# EAGLE design GRBLduino_Uno_Rev3-02-TH (EAGLE 7.6.0)

## Sheet 1 of 2
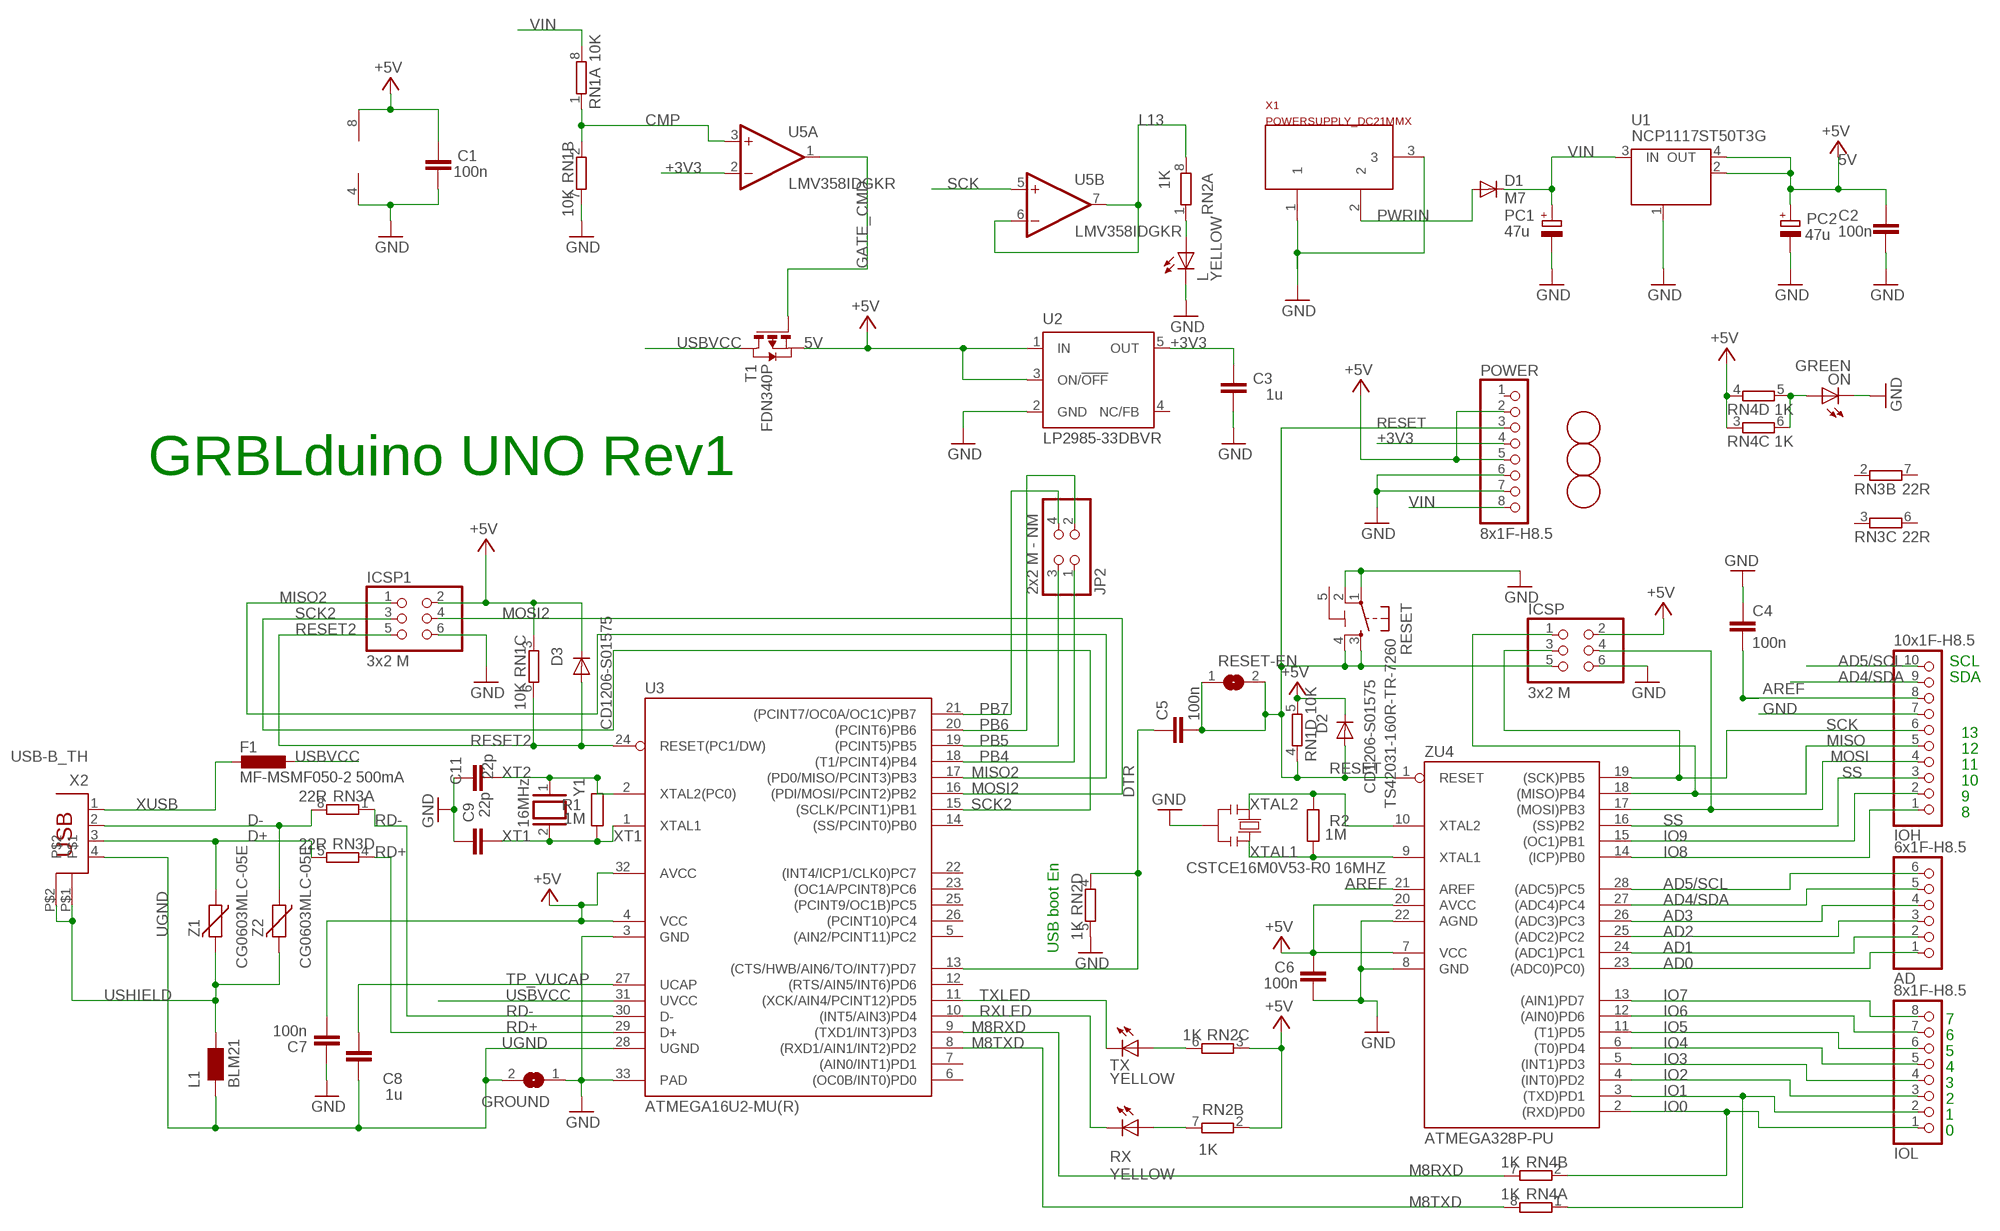
[diagram p0: schematic, sheet 1]

### Parts
AD  6x1F-H8.5  PINHD-1X6  [1X06]
C1  100n  C-EU0603-RND  [C0603-ROUND]
C2  100n  C-EU0603-RND  [C0603-ROUND]
C3  1u  C-EU0603-RND  [C0603-ROUND]
C4  100n  C-EU0603-RND  [C0603-ROUND]
C5  100n  C-EU0603-RND  [C0603-ROUND]
C6  100n  C-EU0603-RND  [C0603-ROUND]
C7  100n  C-EU0603-RND  [C0603-ROUND]
C8  1u  C-EU0603-RND  [C0603-ROUND]
C9  22p  C-EU0603-RND  [C0603-ROUND]
C11  22p  C-EU0603-RND  [C0603-ROUND]
D1  M7  DIODE-SMB  [SMB]
D2  CD1206-S01575  DIODE-MINIMELF  [MINIMELF]
D3  CD1206-S01575  DIODE-MINIMELF  [MINIMELF]
F1  MF-MSMF050-2 500mA  L-EUL1812  [L1812]
FD1  FIDUCIALMOUNT  [FIDUCIA-MOUNT]
FD2  FIDUCIALMOUNT  [FIDUCIA-MOUNT]
FD3  FIDUCIALMOUNT  [FIDUCIA-MOUNT]
GROUND  SJ  [SJ]
ICSP  3x2 M  PINHD-2X3  [2X03]
ICSP1  3x2 M  PINHD-2X3  [2X03]
IOH  10x1F-H8.5  PINHD-1X10_ARD  [1X10]
IOL  8x1F-H8.5  PINHD-1X8  [1X08]
JP2  2x2 M - NM  PINHD-2X2  [2X02]
L  YELLOW  LEDCHIP-LED0805  [CHIP-LED0805]
L1  BLM21  WE-CBF_0805  [0805]
ON  GREEN  LEDCHIP-LED0805  [CHIP-LED0805]
PC1  47u  CPOL-EUD  [PANASONIC_D]
PC2  47u  CPOL-EUD  [PANASONIC_D]
POWER  8x1F-H8.5  PINHD-1X8  [1X08]
R1  1M  R-EU_R0603  [R0603-ROUND]
R2  1M  R-EU_R0603  [R0603-ROUND]
RESET  TS42031-160R-TR-7260  TS42  [TS42]
RESET-EN  SJ  [SJ]
RN1  10K  4R-NCAY16  [CAY16]
RN2  1K  4R-NCAY16  [CAY16]
RN3  22R  4R-NCAY16  [CAY16]
RN4  1K  4R-NCAY16  [CAY16]
RX  YELLOW  LEDCHIP-LED0805  [CHIP-LED0805]
T1  FDN340P  PMOSSOT23  [SOT-23]
TX  YELLOW  LEDCHIP-LED0805  [CHIP-LED0805]
U1  NCP1117ST50T3G  MC33269ST-3.3T3  [SOT223]
U2  LP2985-33DBVR  LP2985-XXDBVR33  [SOT23-DBV]
U3  ATMEGA16U2-MU(R)  ATMEGA16U2-MU  [MLF32]
U5  LMV358IDGKR  LMV358MMX  [MSOP08]
X1  POWERSUPPLY_DC21MMX  [POWERSUPPLY_DC-21MM]
X2  USB-B_TH  PN61729  [PN61729]
Y1  16MHz  XTAL/S  [QS]
Y2  CSTCE16M0V53-R0 16MHZ  RESONATORMU  [RESONATOR]
Z1  CG0603MLC-05E  VARISTORCN0603  [CT/CN0603]
Z2  CG0603MLC-05E  VARISTORCN0603  [CT/CN0603]
ZU4  ATMEGA328P-PU  [DIL28-3]

### Nets
5V: C1.2 C2.2 C6.2 C7.1 D2.C D3.C ICSP1.2 ICSP.2 PC2.+ POWER.2 POWER.5 RN1.3 RN1.5 RN2.2 RN2.3 RN4.3 RN4.4 T1.2(S) U1.2(OUT) U1.4(OUT) U2.1(IN) U2.3(ON/!OFF) U3.4(VCC) U3.32(AVCC) U5.8(P:V+) ZU4.7(VCC) ZU4.20(AVCC) ; supply symbol labelled +5V ; also sheet 2
+3V3: C3.2 POWER.4 U2.5(OUT) U5.2(A:-IN)
AD0: AD.1 ZU4.23((ADC0)PC0)) ; also sheet 2
AD1: AD.2 ZU4.24((ADC1)PC1) ; also sheet 2
AD2: AD.3 ZU4.25((ADC2)PC2) ; also sheet 2
AD3: AD.4 ZU4.26((ADC3)PC3) ; also sheet 2
AD4/SDA: AD.5 IOH.9 ZU4.27((ADC4)PC4) ; also sheet 2
AD5/SCL: AD.6 IOH.10 ZU4.28((ADC5)PC5) ; also sheet 2
AREF [aref]: C4.2 IOH.8 ZU4.21(AREF)
CMP: RN1.1 RN1.2 U5.3(A:+IN)
D+: RN3.5 X2.3 Z1.1
D-: RN3.8 X2.2 Z2.1
DTR: C5.1 RN2.4 U3.13((CTS/HWB/AIN6/TO/INT7)PD7)
GATE_CMD: T1.3(G) U5.1(A:OUT)
GND [GND]: C1.1 C2.1 C3.1 C4.1 C6.1 C7.2 C9.2 C11.2 GROUND.1 ICSP1.6 ICSP.6 IOH.7 L.C ON.C PC1.- PC2.- POWER.6 POWER.7 RESET.1 RESET.2 RN1.7 RN2.5 U1.1(GND/ADJ) U2.2(GND) U3.3(GND) U3.33(PAD) U5.4(P:V-) X1.1 X1.3 Y2.2 ZU4.8(GND) ZU4.22(AGND) ; also sheet 2
IO0: IOL.1 RN4.2 ZU4.2((RXD)PD0)
IO1: IOL.2 RN4.1 ZU4.3((TXD)PD1)
IO2: IOL.3 ZU4.4((INT0)PD2) ; also sheet 2
IO3: IOL.4 ZU4.5((INT1)PD3) ; also sheet 2
IO4: IOL.5 ZU4.6((T0)PD4) ; also sheet 2
IO5: IOL.6 ZU4.11((T1)PD5) ; also sheet 2
IO6: IOL.7 ZU4.12((AIN0)PD6) ; also sheet 2
IO7: IOL.8 ZU4.13((AIN1)PD7) ; also sheet 2
IO8: IOH.1 ZU4.14((ICP)PB0) ; also sheet 2
IO9: IOH.2 ZU4.15((OC1)PB1) ; also sheet 2
L13: RN2.8 U5.6(B:-IN) U5.7(B:OUT)
M8RXD: RN4.7 U3.9((TXD1/INT3)PD3)
M8TXD: RN4.8 U3.8((RXD1/AIN1/INT2)PD2)
MISO: ICSP.1 IOH.5 ZU4.18((MISO)PB4) ; also sheet 2
MISO2: ICSP1.1 U3.17((PD0/MISO/PCINT3)PB3)
MOSI: ICSP.4 IOH.4 ZU4.17((MOSI)PB3) ; also sheet 2
MOSI2: ICSP1.4 U3.16((PDI/MOSI/PCINT2)PB2)
N$1: L.A RN2.1
N$3: ON.A RN4.5 RN4.6
N$35: RN2.7 RX.A
N$36: RN2.6 TX.A
PB4: JP2.1 U3.18((T1/PCINT4)PB4)
PB5: JP2.3 U3.19((PCINT5)PB5)
PB6: JP2.2 U3.20((PCINT6)PB6)
PB7: JP2.4 U3.21((PCINT7/OC0A/OC1C)PB7)
PWRIN [power]: D1.A X1.2
RD+: RN3.4 U3.29(D+)
RD-: RN3.1 U3.30(D-)
RESET: C5.2 D2.A ICSP.5 POWER.3 RESET-EN.1 RESET-EN.2 RESET.3 RESET.4 RN1.4 ZU4.1(RESET) ; also sheet 2
RESET2: D3.A ICSP1.5 RN1.6 U3.24(RESET(PC1/DW))
RXLED: RX.C U3.10((INT5/AIN3)PD4)
SCK: ICSP.3 IOH.6 U5.5(B:+IN) ZU4.19((SCK)PB5) ; also sheet 2
SCK2: ICSP1.3 U3.15((SCLK/PCINT1)PB1)
SS: IOH.3 ZU4.16((SS)PB2) ; also sheet 2
TP_VUCAP: C8.1 U3.27(UCAP)
TXLED: TX.C U3.11((XCK/AIN4/PCINT12)PD5)
UGND [GND]: C8.2 GROUND.2 L1.1 U3.28(UGND) X2.4
USBVCC [usbvcc]: F1.1 T1.1(D) U3.31(UVCC)
USHIELD [GND]: L1.2 X2.P$1 X2.P$2 Z1.2 Z2.2
VIN [power]: D1.C PC1.+ POWER.8 RN1.8 U1.3(IN)
XT1: C9.1 R1.1 U3.1(XTAL1) Y1.2
XT2: C11.1 R1.2 U3.2(XTAL2(PC0)) Y1.1
XTAL1: R2.1 Y2.3 ZU4.9(XTAL1)
XTAL2: R2.2 Y2.1 ZU4.10(XTAL2)
XUSB [usbvcc]: F1.2 X2.1
Unconnected: POWER.1 RN3.2 RN3.3 RN3.6 RN3.7 U2.4(NC/FB) U3.5((AIN2/PCINT11)PC2) U3.6((OC0B/INT0)PD0) U3.7((AIN0/INT1)PD1) U3.12((RTS/AIN5/INT6)PD6) U3.14((SS/PCINT0)PB0) U3.22((INT4/ICP1/CLK0)PC7) U3.23((OC1A/PCINT8)PC6) U3.25((PCINT9/OC1B)PC5) U3.26((PCINT10)PC4)

### Notes on the sheet
- GRBLduino UNO Rev1
- SCL
- SDA
- 13
- 12
- 11
- 10
- 9
- 8
- USB boot En
- 7
- 6
- 5
- 4
- 3
- 2
- 1
- 0

## Sheet 2 of 2
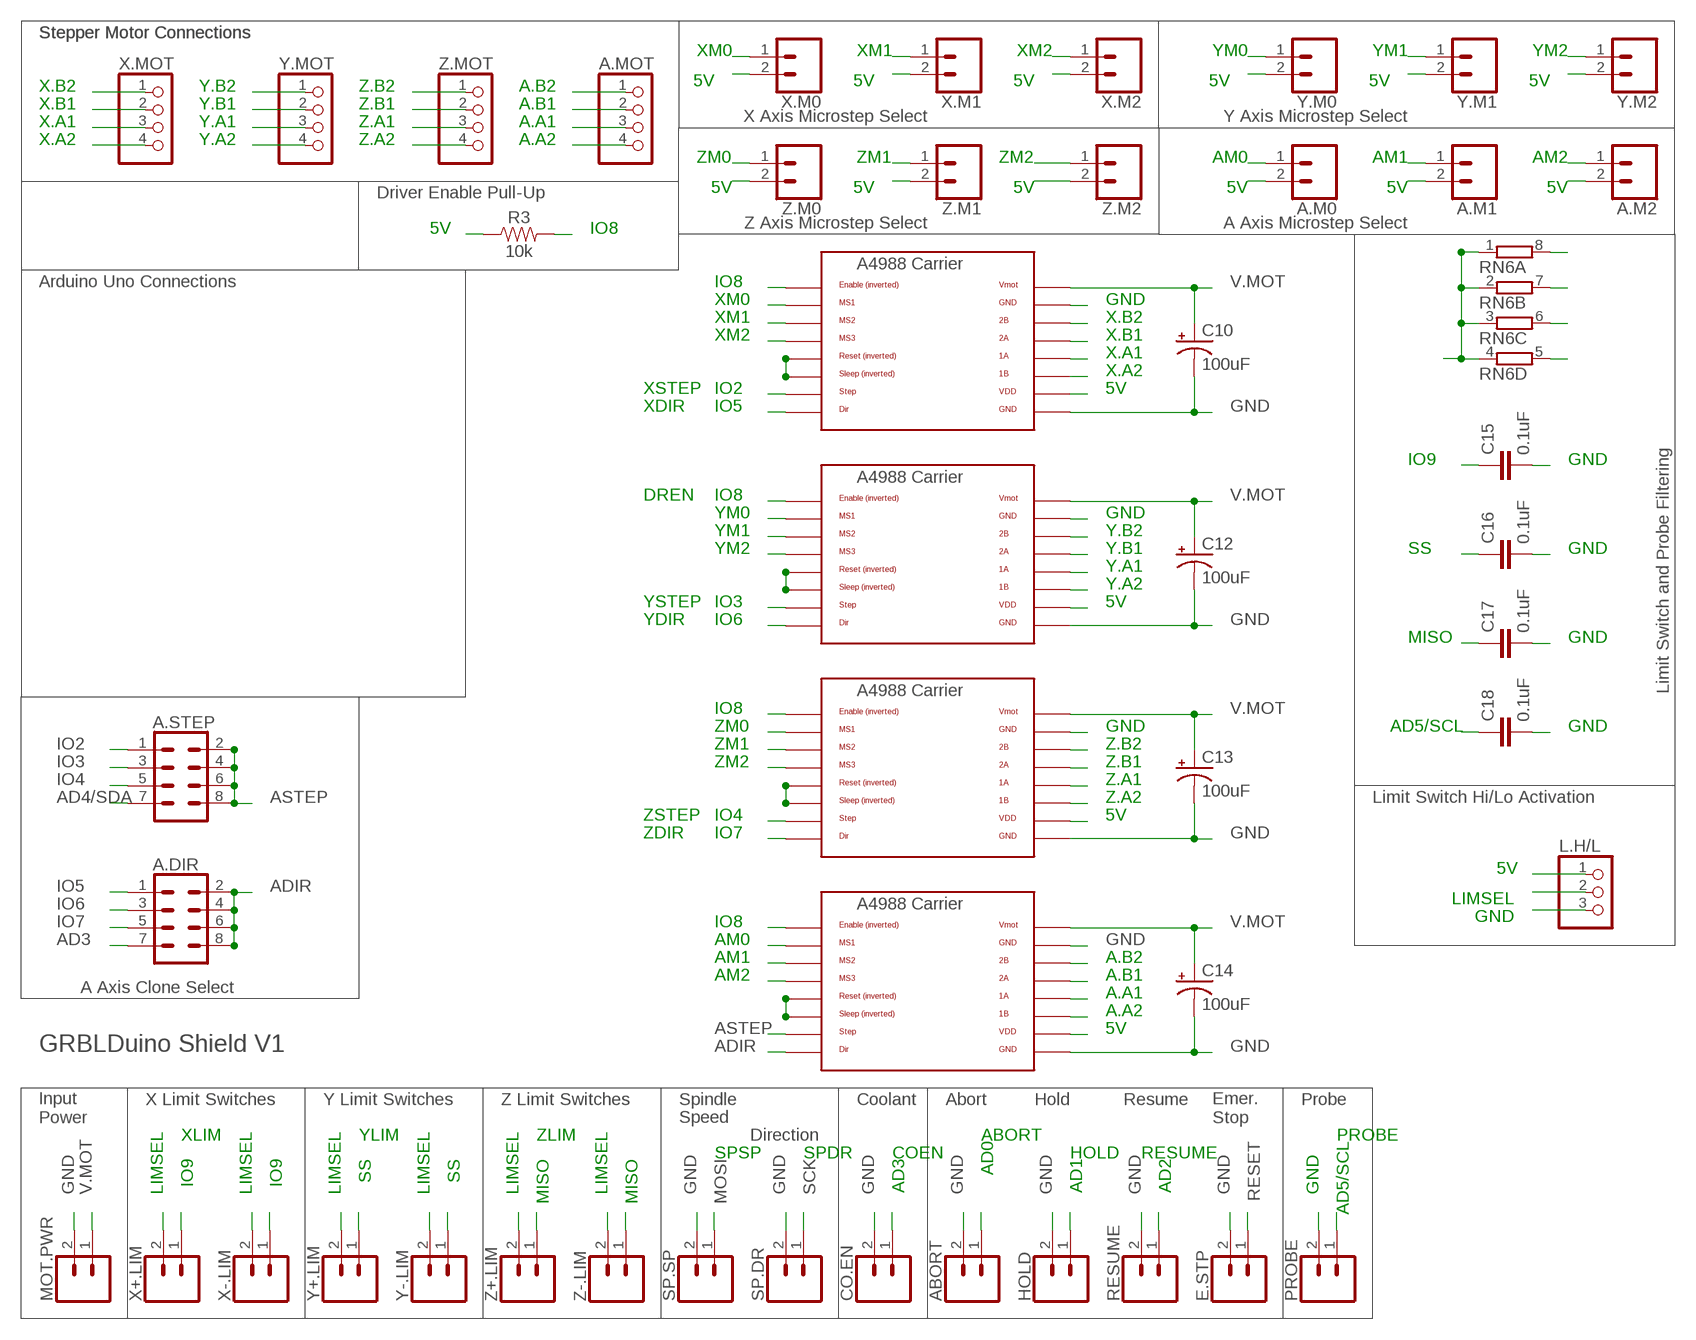
[diagram p1: schematic, sheet 2]

### Parts
A.DIR  CONN_04X2  [2X4]
A.DRV  A Driver  A4988BREAKOUT  [A4988BREAKOUT]
A.M0  CONN_02  [1X02]
A.M1  CONN_02  [1X02]
A.M2  CONN_02  [1X02]
A.MOT  PINHD-1X4  [1X04]
A.STEP  CONN_04X2  [2X4]
ABORT  CONN_025MM  [SCREWTERMINAL-5MM-2]
C10  100uF  100UF-POLAR-RADIAL-2.5MM-25V-20%  [CPOL-RADIAL-2.5MM-6.5MM]
C12  100uF  100UF-POLAR-RADIAL-2.5MM-25V-20%  [CPOL-RADIAL-2.5MM-6.5MM]
C13  100uF  100UF-POLAR-RADIAL-2.5MM-25V-20%  [CPOL-RADIAL-2.5MM-6.5MM]
C14  100uF  100UF-POLAR-RADIAL-2.5MM-25V-20%  [CPOL-RADIAL-2.5MM-6.5MM]
C15  0.1uF  0.1UF-0603-25V-5%  [0603]
C16  0.1uF  0.1UF-0603-25V-5%  [0603]
C17  0.1uF  0.1UF-0603-25V-5%  [0603]
C18  0.1uF  0.1UF-0603-25V-5%  [0603]
CO.EN  CONN_025MM  [SCREWTERMINAL-5MM-2]
E.STP  CONN_025MM  [SCREWTERMINAL-5MM-2]
HOLD  CONN_025MM  [SCREWTERMINAL-5MM-2]
L.H/L  PINHD-1X3  [1X03]
MOT.PWR  CONN_025MM  [SCREWTERMINAL-5MM-2]
PROBE  CONN_025MM  [SCREWTERMINAL-5MM-2]
R3  10k  10KOHM-0603-1/10W-1%  [0603]
RESUME  CONN_025MM  [SCREWTERMINAL-5MM-2]
RN6  4R-N0603-ARC  [0603-ARC]
SP.DR  CONN_025MM  [SCREWTERMINAL-5MM-2]
SP.SP  CONN_025MM  [SCREWTERMINAL-5MM-2]
X+.LIM  CONN_025MM  [SCREWTERMINAL-5MM-2]
X-.LIM  CONN_025MM  [SCREWTERMINAL-5MM-2]
X.DRV  X Driver  POLOLU_A4983CARRIER  [A4988BREAKOUT]
X.M0  CONN_02  [1X02]
X.M1  CONN_02  [1X02]
X.M2  CONN_02  [1X02]
X.MOT  PINHD-1X4  [1X04]
Y+.LIM  CONN_025MM  [SCREWTERMINAL-5MM-2]
Y-.LIM  CONN_025MM  [SCREWTERMINAL-5MM-2]
Y.DRV  Y Driver  POLOLU_A4983CARRIER  [A4988BREAKOUT]
Y.M0  CONN_02  [1X02]
Y.M1  CONN_02  [1X02]
Y.M2  CONN_02  [1X02]
Y.MOT  PINHD-1X4  [1X04]
Z+.LIM  CONN_025MM  [SCREWTERMINAL-5MM-2]
Z-.LIM  CONN_025MM  [SCREWTERMINAL-5MM-2]
Z.DRV  Z Driver  POLOLU_A4983CARRIER  [A4988BREAKOUT]
Z.M0  CONN_02  [1X02]
Z.M1  CONN_02  [1X02]
Z.M2  CONN_02  [1X02]
Z.MOT  PINHD-1X4  [1X04]

### Nets
5V: A.DRV.VDD A.M0.2 A.M1.2 A.M2.2 L.H/L.1 R3.1 RN6.1 RN6.2 RN6.3 RN6.4 X.DRV.VDD X.M0.2 X.M1.2 X.M2.2 Y.DRV.VDD Y.M0.2 Y.M1.2 Y.M2.2 Z.DRV.VDD Z.M0.2 Z.M1.2 Z.M2.2 ; also sheet 1
A.A1: A.DRV.1A A.MOT.3
A.A2: A.DRV.1B A.MOT.4
A.B1: A.DRV.2A A.MOT.2
A.B2: A.DRV.2B A.MOT.1
AD0: ABORT.1 ; also sheet 1
AD1: HOLD.1 ; also sheet 1
AD2: RESUME.1 ; also sheet 1
AD3: A.DIR.7 CO.EN.1 ; also sheet 1
AD4/SDA: A.STEP.7 ; also sheet 1
AD5/SCL: C18.1 PROBE.1 RN6.5 ; also sheet 1
ADIR: A.DIR.2 A.DIR.4 A.DIR.6 A.DIR.8 A.DRV.DIR
AM0: A.DRV.MS1 A.M0.1
AM1: A.DRV.MS2 A.M1.1
AM2: A.DRV.MS3 A.M2.1
ASTEP: A.DRV.STEP A.STEP.2 A.STEP.4 A.STEP.6 A.STEP.8
GND [GND]: A.DRV.GND A.DRV.GND@0(GND) ABORT.2 C10.2(-) C12.2(-) C13.2(-) C14.2(-) C15.2 C16.2 C17.2 C18.2 CO.EN.2 E.STP.2 HOLD.2 L.H/L.3 MOT.PWR.2 PROBE.2 RESUME.2 SP.DR.2 SP.SP.2 X.DRV.GND X.DRV.GND@0(GND) Y.DRV.GND Y.DRV.GND@0(GND) Z.DRV.GND Z.DRV.GND@0(GND) ; also sheet 1
IO2: A.STEP.1 X.DRV.STEP ; also sheet 1
IO3: A.STEP.3 Y.DRV.STEP ; also sheet 1
IO4: A.STEP.5 Z.DRV.STEP ; also sheet 1
IO5: A.DIR.1 X.DRV.DIR ; also sheet 1
IO6: A.DIR.3 Y.DRV.DIR ; also sheet 1
IO7: A.DIR.5 Z.DRV.DIR ; also sheet 1
IO8: A.DRV.EN R3.2 X.DRV.EN Y.DRV.EN Z.DRV.EN ; also sheet 1
IO9: C15.1 RN6.8 X+.LIM.1 X-.LIM.1 ; also sheet 1
LIMSEL: L.H/L.2 X+.LIM.2 X-.LIM.2 Y+.LIM.2 Y-.LIM.2 Z+.LIM.2 Z-.LIM.2
MISO: C17.1 RN6.6 Z+.LIM.1 Z-.LIM.1 ; also sheet 1
MOSI: SP.SP.1 ; also sheet 1
N$11: X.DRV.RST X.DRV.SLP(SLEEP)
N$12: Y.DRV.RST Y.DRV.SLP(SLEEP)
N$13: Z.DRV.RST Z.DRV.SLP(SLEEP)
N$14: A.DRV.RST A.DRV.SLP(SLEEP)
RESET: E.STP.1 ; also sheet 1
SCK: SP.DR.1 ; also sheet 1
SS: C16.1 RN6.7 Y+.LIM.1 Y-.LIM.1 ; also sheet 1
V.MOT [power]: A.DRV.VMOT C10.1(+) C12.1(+) C13.1(+) C14.1(+) MOT.PWR.1 X.DRV.VMOT Y.DRV.VMOT Z.DRV.VMOT
X.A1: X.DRV.1A X.MOT.3
X.A2: X.DRV.1B X.MOT.4
X.B1: X.DRV.2A X.MOT.2
X.B2: X.DRV.2B X.MOT.1
XM0: X.DRV.MS1 X.M0.1
XM1: X.DRV.MS2 X.M1.1
XM2: X.DRV.MS3 X.M2.1
Y.A1: Y.DRV.1A Y.MOT.3
Y.A2: Y.DRV.1B Y.MOT.4
Y.B1: Y.DRV.2A Y.MOT.2
Y.B2: Y.DRV.2B Y.MOT.1
YM0: Y.DRV.MS1 Y.M0.1
YM1: Y.DRV.MS2 Y.M1.1
YM2: Y.DRV.MS3 Y.M2.1
Z.A1: Z.DRV.1A Z.MOT.3
Z.A2: Z.DRV.1B Z.MOT.4
Z.B1: Z.DRV.2A Z.MOT.2
Z.B2: Z.DRV.2B Z.MOT.1
ZM0: Z.DRV.MS1 Z.M0.1
ZM1: Z.DRV.MS2 Z.M1.1
ZM2: Z.DRV.MS3 Z.M2.1

### Notes on the sheet
- Stepper Motor Connections | Stepper Motor Connections
- X Axis Microstep Select | Y Axis Microstep Select
- Driver Enable Pull-Up
- Z Axis Microstep Select | A Axis Microstep Select
- Arduino Uno Connections
- XSTEP
- XDIR
- Limit Switch and Probe Filtering
- DREN
- YSTEP
- YDIR
- Limit Switch Hi/Lo Activation
- ZSTEP
- ZDIR
- A Axis Clone Select
- GRBLDuino Shield V1
- X Limit Switches | Y Limit Switches | Z Limit Switches | Spindle | Coolant | Abort | Hold | Resume | Probe
- Input
  Power
- Speed
- Emer.
  Stop
- XLIM | YLIM | ZLIM | Direction | ABORT | PROBE
- SPSP | SPDR | COEN | HOLD | RESUME

## Power pins joined to a net without a drawn wire
5-GND: RESET.5(5-GND)

## Library data of the parts
A.DIR A.STEP = SparkFun-Connectors:CONN_04X2: Multi connection point. Often used as Generic Header-pin footprint for 0.1 inch spaced/style header connections On any of the 0.1 inch spaced packages, you can populate with these: Break Away Headers - Straight <https://www.sparkfun.com/products/116> (PRT-00116) Break Away Male Headers - Right Angle <https://www.sparkfun.com/products/553> (PRT-00553) Female Headers <https://www.sparkfun.com/products/115> (PRT-00115) Break Away Headers - Machine Pin <https://www.sparkfun.com/products/117> (PRT-00117) Break Away Female Headers - Swiss Machine Pin <https://www.sparkfun.com/products/743> (PRT-00743)
A.DRV = RepRapjr:A4988BREAKOUT
A.M0 A.M1 A.M2 X.M0 X.M1 X.M2 Y.M0 Y.M1 Y.M2 Z.M0 Z.M1 Z.M2 = SparkFun-Connectors:CONN_02: Multi connection point. Often used as Generic Header-pin footprint for 0.1 inch spaced/style header connections On any of the 0.1 inch spaced packages, you can populate with these: Break Away Headers - Straight <https://www.sparkfun.com/products/116> (PRT-00116) Break Away Male Headers - Right Angle <https://www.sparkfun.com/products/553> (PRT-00553) Female Headers <https://www.sparkfun.com/products/115> (PRT-00115) Break Away Headers - Machine Pin <https://www.sparkfun.com/products/117> (PRT-00117) Break Away Female Headers - Swiss Machine Pin <https://www.sparkfun.com/products/743> (PRT-00743) For SCREWTERMINALS and SPRING TERMINALS visit here: Screw Terimnals on SparkFun.com <https://www.sparkfun.com/search/results?term=Screw+Terminals> (5mm/3.5mm/2.54mm spacing) This device is also useful as a general connection point to wire up your design to another part of your project. Our various solder wires solder well into these plated through hole pads. Hook-Up Wire - Assortment (Stranded, 22 AWG) <https://www.sparkfun.com/products/11375> (PRT-11375) Hook-Up Wire - Assortment (Solid Core, 22 AWG) <https://www.sparkfun.com/products/11367> (PRT-11367) View the entire wire category on our website here <https://www.sparkfun.com/categories/141> Special notes: Molex polarized connector foot print use with: PRT-08233 with associated crimp pins and housings. 2.54_SCREWTERM for use with PRT-10571. 3.5mm Screw Terminal footprints for PRT-08084 5mm Screw Terminal footprints for use with PRT-08432
A.MOT X.MOT Y.MOT Z.MOT = pinhead:PINHD-1X4: PIN HEADER
ABORT CO.EN E.STP HOLD MOT.PWR PROBE RESUME SP.DR SP.SP X+.LIM X-.LIM Y+.LIM Y-.LIM Z+.LIM Z-.LIM = SparkFun-Connectors:CONN_02: Multi connection point. Often used as Generic Header-pin footprint for 0.1 inch spaced/style header connections On any of the 0.1 inch spaced packages, you can populate with these: Break Away Headers - Straight <https://www.sparkfun.com/products/116> (PRT-00116) Break Away Male Headers - Right Angle <https://www.sparkfun.com/products/553> (PRT-00553) Female Headers <https://www.sparkfun.com/products/115> (PRT-00115) Break Away Headers - Machine Pin <https://www.sparkfun.com/products/117> (PRT-00117) Break Away Female Headers - Swiss Machine Pin <https://www.sparkfun.com/products/743> (PRT-00743) For SCREWTERMINALS and SPRING TERMINALS visit here: Screw Terimnals on SparkFun.com <https://www.sparkfun.com/search/results?term=Screw+Terminals> (5mm/3.5mm/2.54mm spacing) This device is also useful as a general connection point to wire up your design to another part of your project. Our various solder wires solder well into these plated through hole pads. Hook-Up Wire - Assortment (Stranded, 22 AWG) <https://www.sparkfun.com/products/11375> (PRT-11375) Hook-Up Wire - Assortment (Solid Core, 22 AWG) <https://www.sparkfun.com/products/11367> (PRT-11367) View the entire wire category on our website here <https://www.sparkfun.com/categories/141> Special notes: Molex polarized connector foot print use with: PRT-08233 with associated crimp pins and housings. 2.54_SCREWTERM for use with PRT-10571. 3.5mm Screw Terminal footprints for PRT-08084 5mm Screw Terminal footprints for use with PRT-08432; SF_SKU: PRT-08432
AD = SmartPrj:PINHD-1X6: PIN HEADER
C1-C9 C11 = SmartPrj:C-EU: CAPACITOR, European symbol
C10 C12-C14 = SparkFun-Capacitors:100UF-POLAR: 100µF polarized capacitors A capacitor is a passive two-terminal electrical component used to store electrical energy temporarily in an electric field.; PROD_ID: CAP-08439
C15-C18 = SparkFun-Capacitors:0.1UF: 0.1µF ceramic capacitors A capacitor is a passive two-terminal electrical component used to store electrical energy temporarily in an electric field.; PROD_ID: CAP-08604
D1-D3 = diode:DIODE-: DIODE
F1 = rcl:L-EU: INDUCTOR, European symbol
FD1-FD3 = SmartPrj:FIDUCIALMOUNT
GROUND RESET-EN = jumper:SJ: SMD solder JUMPER
ICSP ICSP1 = SmartPrj:PINHD-2X3: PIN HEADER
IOH = SmartPrj:PINHD-1X10_ARD: PIN HEADER
IOL POWER = SmartPrj:PINHD-1X8: PIN HEADER
JP2 = SmartPrj:PINHD-2X2: PIN HEADER
L ON RX TX = led:LED: LED OSRAM: - CHIPLED LG R971, LG N971, LY N971, LG Q971, LY Q971, LO R971, LY R971 LH N974, LH R974 LS Q976, LO Q976, LY Q976 LO Q996 - Hyper CHIPLED LW Q18S LB Q993, LB Q99A, LB R99A - SideLED LS A670, LO A670, LY A670, LG A670, LP A670 LB A673, LV A673, LT A673, LW A673 LH A674 LY A675 LS A676, LA A676, LO A676, LY A676, LW A676 LS A679, LY A679, LG A679 - Hyper Micro SIDELED® LS Y876, LA Y876, LO Y876, LY Y876 LT Y87S - SmartLED LW L88C, LW L88S LB L89C, LB L89S, LG L890 LS L89K, LO L89K, LY L89K LS L896, LA L896, LO L896, LY L896 - TOPLED LS T670, LO T670, LY T670, LG T670, LP T670 LSG T670, LSP T670, LSY T670, LOP T670, LYG T670 LG T671, LOG T671, LSG T671 LB T673, LV T673, LT T673, LW T673 LH T674 LS T676, LA T676, LO T676, LY T676, LB T676, LH T676, LSB T676, LW T676 LB T67C, LV T67C, LT T67C, LS T67K, LO T67K, LY T67K, LW E67C LS E67B, LA E67B, LO E67B, LY E67B, LB E67C, LV E67C, LT E67C LW T67C LS T679, LY T679, LG T679 LS T770, LO T770, LY T770, LG T770, LP T770 LB T773, LV T773, LT T773, LW T773 LH T774 LS E675, LA E675, LY E675, LS T675 LS T776, LA T776, LO T776, LY T776, LB T776 LHGB T686 LT T68C, LB T68C - Hyper Mini TOPLED® LB M676 - Mini TOPLED Santana® LG M470 LS M47K, LO M47K, LY M47K Source: http://www.osram.convergy.de LUXEON: - LUMILED® LXK2-PW12-R00, LXK2-PW12-S00, LXK2-PW14-U00, LXK2-PW14-V00 LXK2-PM12-R00, LXK2-PM12-S00, LXK2-PM14-U00 LXK2-PE12-Q00, LXK2-PE12-R00, LXK2-PE12-S00, LXK2-PE14-T00, LXK2-PE14-U00 LXK2-PB12-K00, LXK2-PB12-L00, LXK2-PB12-M00, LXK2-PB14-N00, LXK2-PB14-P00, LXK2-PB14-Q00 LXK2-PR12-L00, LXK2-PR12-M00, LXK2-PR14-Q00, LXK2-PR14-R00 LXK2-PD12-Q00, LXK2-PD12-R00, LXK2-PD12-S00 LXK2-PH12-R00, LXK2-PH12-S00 LXK2-PL12-P00, LXK2-PL12-Q00, LXK2-PL12-R00 Source: www.luxeon.com KINGBRIGHT: KA-3528ASYC Source: www.kingbright.com
L1 = wuerth-elektronik:WE-CBF: SMD EMI Suppression Ferrite Beads - excellent anti-EMI properties - low DCR - impedances till 3000 ohms - rated current up to 6 A
L.H/L = pinhead:PINHD-1X3: PIN HEADER
PC1 PC2 = rcl:CPOL-EU: POLARIZED CAPACITOR, European symbol
R1 R2 = SmartPrj:R-EU_: RESISTOR, European symbol
R3 = SparkFun-Resistors:10KOHM: 10kΩ resistor A resistor is a passive two-terminal electrical component that implements electrical resistance as a circuit element. Resistors act to reduce current flow, and, at the same time, act to lower voltage levels within circuits. - Wikipedia; PROD_ID: RES-00824
RESET = SmartPrj:TS42: TS42 Dongnan Electronics Tact switch VDC 12V - 50mA
RN1-RN4 RN6 = resistor-dil:4R-N: Array Chip Resistor Source: RS Component / Phycomp; OC_FARNELL: unknown; OC_NEWARK: unknown
T1 = zetex:PMOSSOT23: MOS FET
U1 = linear:MC33269ST*: Adjustable Output Low Dropout Voltage Regulator 800 mA Source: http://www.onsemi.com/pub/Collateral/MC33269-D.PDF
U2 = SmartPrj:LP2985-XXDBVR: ULTRALOW-POWER 50-mA LOW-DROPOUT LINEAR REGULATORS 50-mA Low-Dropout Regulator Source: http://focus.ti.com/lit/ds/symlink/tps77001.pdf
U3 = SmartPrj:ATMEGA16U2-
U5 = linear:LMV358?*: Dual General Purpose, Low Voltage, Rail-to-Rail Output Operational Amplifiers Source: http://www.national.com/mpf/LM/LMV321.html http://www.national.com/dt/lmv_qual.pdf
X1 = SmartPrj:POWERSUPPLY_DC21MM
X2 = SmartPrj:PN61729: BERG USB connector
X.DRV Y.DRV Z.DRV = RepRapjr:POLOLU_A4983CARRIER
Y1 = SmartPrj:XTAL/S: CRYSTAL
Y2 = SmartPrj:RESONATOR
Z1 Z2 = varistor:VARISTOR: VARISTOR
ZU4 = SmartPrj:ATMEGA328P-: MICROCONTROLLER 4 Kbytes FLASH 128 bytes SRAM 256 bytes EEPROM UART 6-channel 10 bit ADC

## Net classes
0 default: width 0.381 mm
1 power: width 0.61 mm, drill 0.61 mm, clearance 0.254 mm
2 GND: width 1.016 mm
3 usbvcc: width 0.508 mm, drill 0.61 mm, clearance 0.254 mm
4 aref: width 0.406 mm, drill 0.61 mm, clearance 0.254 mm
5 VMOT: width 1.016 mm, clearance 0.254 mm

## Board
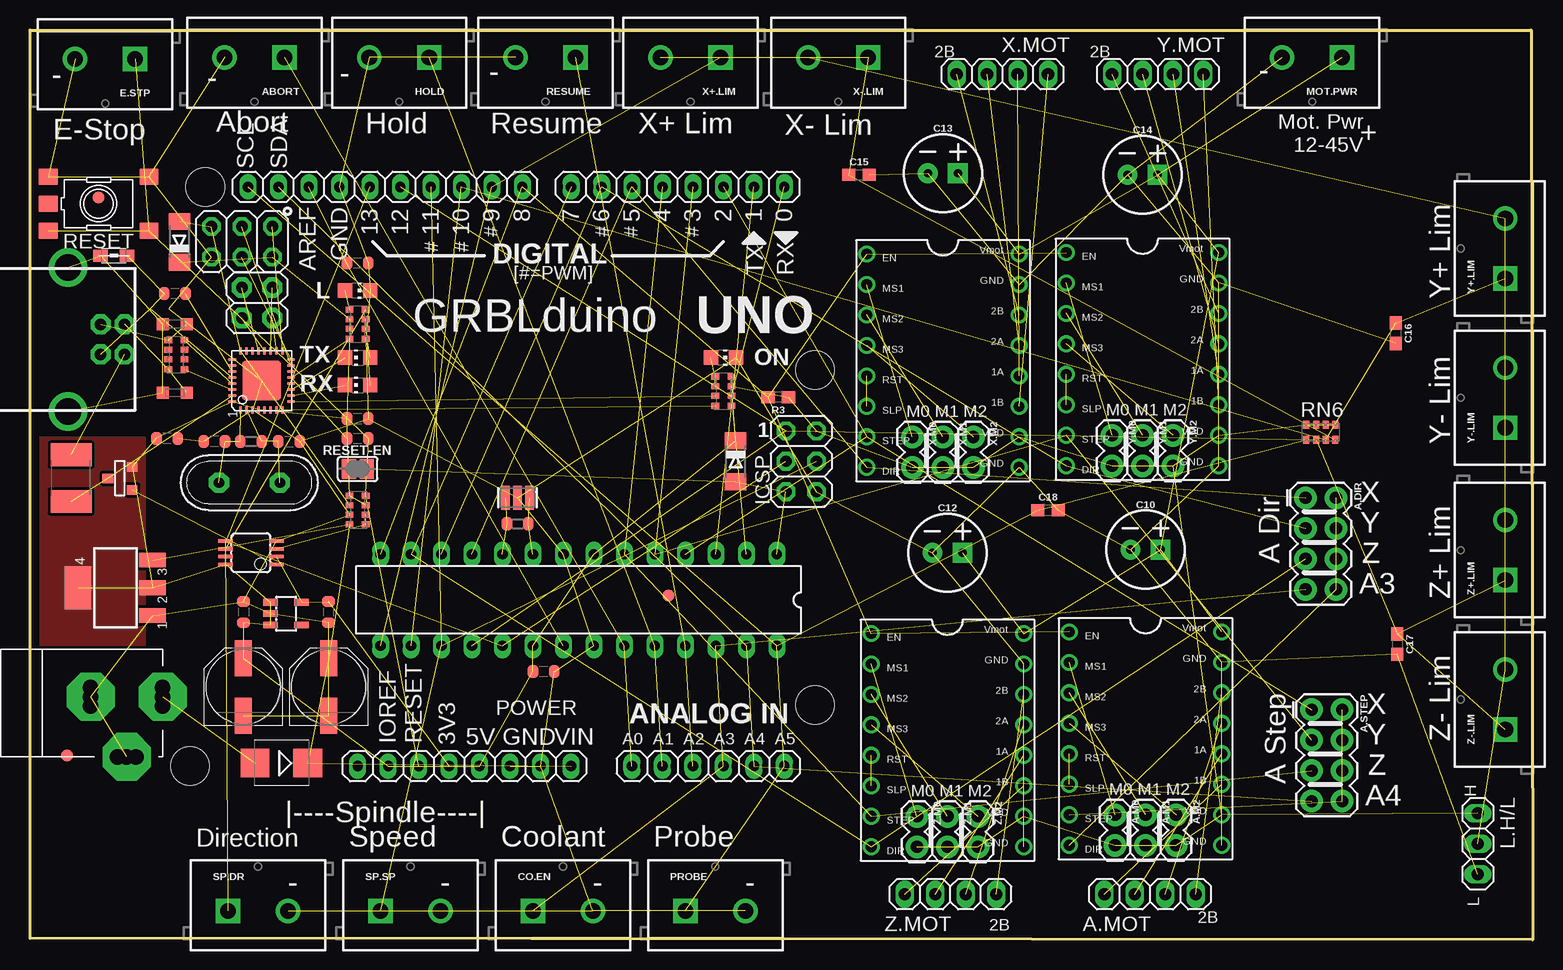
[diagram p2: board, top side]
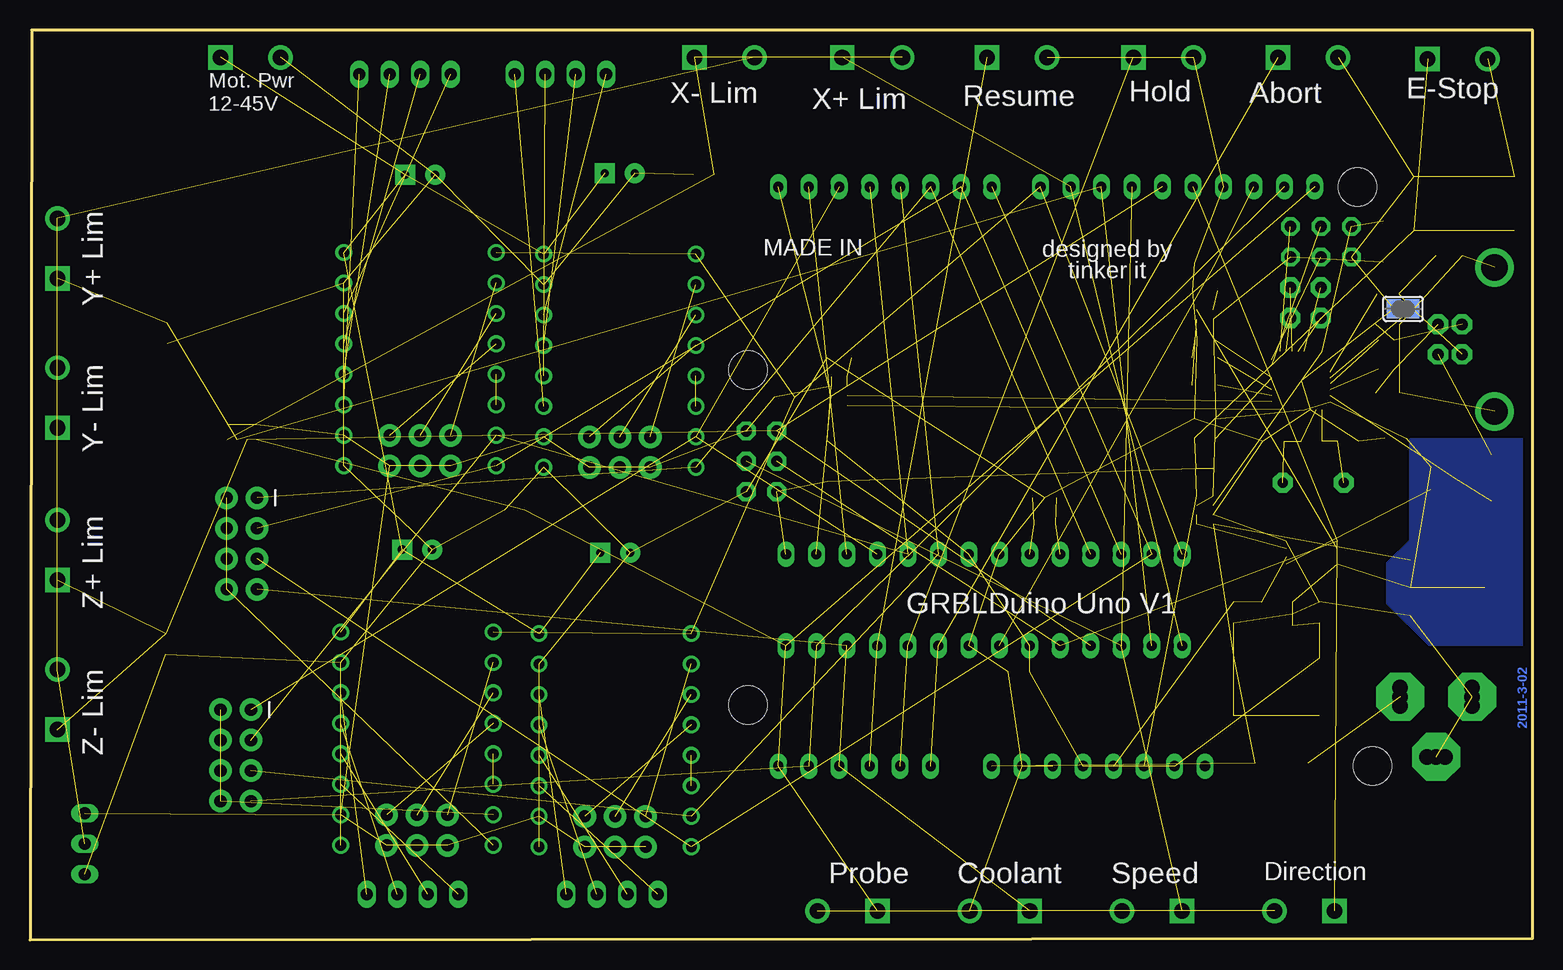
[diagram p3: board, bottom side, seen from below]

Size 125.22 x 75.82 mm. Coordinates in mm from the lower left corner, seen from the top.
Outline: 0,75.82 125.09,75.82 125.22,0 0,0.13 0,75.82
Copper layers (1*16): Top 0.035mm / dielectric 1.5mm / Bottom 0.035mm
Design rules "default": minimum track width 10mil, minimum drill 22mil, track to track 10mil, track to pad 10mil, pad to pad 10mil, via to via 12mil, smd to smd 8mil, copper to edge 26mil, drill to drill 12mil, minimum pad ring 10mil, minimum via ring 10mil, stop-mask expansion 1mil, vias tented up to drill 30mil, thermal gap 10mil
Holes 3.2 mm at 65.41,47.5 65.41,19.56 14.61,62.74 13.34,14.48
vRestrict: area 22.2,56 to 24,61.1; area 24.8,57.4 to 26.4,61.1; area 27.8,57.3 to 29,60.7; area 30.4,57.3 to 31.5,60.7; area 32.9,57.3 to 34,60.7; area 35.4,57.3 to 36.6,60.7; area 38.1,59.2 to 39.2,60.7; area 39.6,57 to 47,58.8; area 59.7,56.1 to 61.1,58.7; area 62.2,56.1 to 63.6,58.7; area 60.7,47.8 to 64.1,49.1; area 0,33.8 to 1.4,42; 14 more areas

### Footprints (pad centres in the part's own frame; a part is rotated, then mirrored left to right if it is on the bottom)
2X4 = drill 1.016 pad 1.88: 1 -3.81,-1.27; 2 -3.81,1.27; 3 -1.27,-1.27; 4 -1.27,1.27; 5 1.27,-1.27; 6 1.27,1.27; 7 3.81,-1.27; 8 3.81,1.27
A4988BREAKOUT = drill 0.9: 1A 8.89,1.27; 1B 11.43,1.27; 2A 6.35,1.27; 2B 3.81,1.27; DIR 16.51,-11.43; EN -1.27,-11.43; GND 16.51,1.27; GND@0 1.27,1.27; MS1 1.27,-11.43; MS2 3.81,-11.43; MS3 6.35,-11.43; RST 8.89,-11.43; SLP 11.43,-11.43; STEP 13.97,-11.43; VDD 13.97,1.27; VMOT -1.27,1.27
1X02 = drill 1.016 pad 1.88: 1 0,0; 2 2.54,0
1X04 = drill 1.016 long: 1 -3.81,0; 2 -1.27,0; 3 1.27,0; 4 3.81,0
SCREWTERMINAL-5MM-2 = drill 1.3 pad 2.032 square: 1 0,0 | drill 1.3 pad 2.032: 2 5,0
1X06 = drill 0.85 pad 1.422 long: 1 -6.35,0; 2 -3.81,0; 3 -1.27,0; 4 1.27,0; 5 3.81,0; 6 6.35,0
C0603-ROUND = smd 0.898 x 1.1: 1 -0.889,0; 2 0.889,0
CPOL-RADIAL-2.5MM-6.5MM = drill 0.7 pad 1.651 square: 1 1.25,0 | drill 0.7 pad 1.651: 2 -1.25,0
0603 = smd 1.1 x 1: 1 -0.85,0; 2 0.85,0
SMB = smd 2.4 x 2.4: A 2.2,0; C -2.2,0
MINIMELF = smd 1.4 x 1.8: A 1.7,0; C -1.7,0
L1812 = smd 1.9 x 3.4: 1 -1.95,0; 2 1.95,0
FIDUCIA-MOUNT = smd 1.016 x 1.016: P$1 0,0
SJ = smd 1.168 x 1.6: 1 -0.762,0; 2 0.762,0
2X03 = drill 0.95 pad 1.55 octagon: 1 -2.54,-1.27; 2 -2.54,1.27; 3 0,-1.27; 4 0,1.27; 5 2.54,-1.27; 6 2.54,1.27
1X10 = drill 0.85 pad 1.422 long: 1 -11.43,0; 2 -8.89,0; 3 -6.35,0; 4 -3.81,0; 5 -1.27,0; 6 1.27,0; 7 3.81,0; 8 6.35,0; 9 8.89,0; 10 11.43,0
1X08 = drill 0.85 pad 1.422 long: 1 -8.89,0; 2 -6.35,0; 3 -3.81,0; 4 -1.27,0; 5 1.27,0; 6 3.81,0; 7 6.35,0; 8 8.89,0
2X02 = drill 0.95 pad 1.676 octagon: 1 -1.27,-1.27; 2 -1.27,1.27; 3 1.27,-1.27; 4 1.27,1.27
CHIP-LED0805 = smd 1.2 x 1.2: A 0,-1.05; C 0,1.05
0805 = smd 1.2 x 1: 1 -1.1,0; 2 1.1,0
1X03 = drill 1.016 long: 1 -2.54,0; 2 0,0; 3 2.54,0
PANASONIC_D = smd 3 x 1.4: + 2.4,0; - -2.4,0
R0603-ROUND = smd 0.898 x 1.1: 1 -0.889,0; 2 0.889,0
TS42 = smd 1.6 x 1.4: 1 -4.2,2.25; 2 4.2,2.25; 3 -4.2,-2.25; 4 4.2,-2.25; 5 -4.2,0
CAY16 = smd 0.5 x 0.65: 1 -1.2,-0.675; 2 -0.4,-0.675; 3 0.4,-0.675; 4 1.2,-0.675; 5 1.2,0.675; 6 0.4,0.675; 7 -0.4,0.675; 8 -1.2,0.675
0603-ARC = smd 0.5 x 0.65: 1 -1.2,-0.625; 2 -0.4,-0.625; 3 0.4,-0.625; 4 1.2,-0.625; 5 1.2,0.625; 6 0.4,0.625; 7 -0.4,0.625; 8 -1.2,0.625
SOT-23 = smd 0.787 x 0.889: 1 0.025,-1.016; 2 -0.94,1.016; 3 0.991,1.016
SOT223 = smd 1.219 x 2.235: 1 -2.311,-3.099; 2 0,-3.099; 3 2.311,-3.099 | smd 3.6 x 2.2: 4 0,3.099
SOT23-DBV = smd 0.55 x 1.2: 1 -0.95,-1.3; 2 0,-1.3; 3 0.95,-1.3; 4 0.95,1.3; 5 -0.95,1.3
MLF32 = smd 0.7 x 0.28: 1 -2.45,1.75; 2 -2.45,1.25; 3 -2.45,0.75; 4 -2.45,0.25; 5 -2.45,-0.25; 6 -2.45,-0.75; 7 -2.45,-1.25; 8 -2.45,-1.75; 17 2.45,-1.75; 18 2.45,-1.25; 19 2.45,-0.75; 20 2.45,-0.25; 21 2.45,0.25; 22 2.45,0.75; 23 2.45,1.25; 24 2.45,1.75 | smd 0.28 x 0.7: 9 -1.75,-2.45; 10 -1.25,-2.45; 11 -0.75,-2.45; 12 -0.25,-2.45; 13 0.25,-2.45; 14 0.75,-2.45; 15 1.25,-2.45; 16 1.75,-2.45; 25 1.75,2.45; 26 1.25,2.45; 27 0.75,2.45; 28 0.25,2.45; 29 -0.25,2.45; 30 -0.75,2.45; 31 -1.25,2.45; 32 -1.75,2.45 | smd 3.254 x 3.254: 33 0,0
MSOP08 = smd 0.3 x 1.2: 1 -0.976,-2.113; 2 -0.326,-2.113; 3 0.324,-2.113; 4 0.974,-2.113; 5 0.974,2.112; 6 0.324,2.112; 7 -0.326,2.112; 8 -0.976,2.112
POWERSUPPLY_DC-21MM = drill 1.3 pad 4 octagon: 1 -5.08,-3.353; 2 -0.076,-6.35; 3 -0.076,-0.356 | drill 1.3: 4 -5.08,-4.115; 5 -5.08,-2.591; 6 -0.838,-0.356; 7 0.686,-0.356; 8 -0.838,-6.35; 9 0.686,-6.35
PN61729 = drill 0.95 pad 1.676 octagon: 1 1.25,4.71; 2 -1.25,4.71; 3 -1.25,2.71; 4 1.25,2.71 | drill 2.2: P$1 -6,0; P$2 6,0
QS = drill 0.85 pad 1.676 octagon: 1 -2.54,0; 2 2.54,0
RESONATOR = smd 0.7 x 2: 1 -1,0; 2 0,0; 3 1,0
CT/CN0603 = smd 1 x 1: 1 -1,0; 2 1,0
DIL28-3 = drill 0.85 pad 1.422 long: 1 -16.51,-3.81; 2 -13.97,-3.81; 3 -11.43,-3.81; 4 -8.89,-3.81; 5 -6.35,-3.81; 6 -3.81,-3.81; 7 -1.27,-3.81; 8 1.27,-3.81; 9 3.81,-3.81; 10 6.35,-3.81; 11 8.89,-3.81; 12 11.43,-3.81; 13 13.97,-3.81; 14 16.51,-3.81; 15 16.51,3.81; 16 13.97,3.81; 17 11.43,3.81; 18 8.89,3.81; 19 6.35,3.81; 20 3.81,3.81; 21 1.27,3.81; 22 -1.27,3.81; 23 -3.81,3.81; 24 -6.35,3.81; 25 -8.89,3.81; 26 -11.43,3.81; 27 -13.97,3.81; 28 -16.51,3.81

### Placement (x,y rotation side)
A.DIR  107.57,33.02 270 top
A.DRV  98.04,24.38 270 top
A.M0  90.42,10.41 270 top
A.M1  92.96,10.41 270 top
A.M2  95.5,10.41 270 top
A.MOT  93.34,3.81 180 top
A.STEP  108.08,15.37 270 top
ABORT  21.21,73.53 180 top
AD  56.52,14.48 0 top
C1  17.78,27.3 270 top
C2  11.43,41.78 180 top
C3  24.89,27.3 90 top
C4  27.3,56.39 180 top
C5  27.3,41.78 0 top
C6  42.8,22.35 180 top
C7  27.3,43.43 0 top
C8  12.06,53.85 180 top
C9  15.37,41.53 180 top
C10  92.96,32.51 0 top
C11  21.59,41.53 0 top
C12  76.45,32.26 0 top
C13  76.07,63.88 0 top
C14  92.71,63.75 0 top
C15  69.09,63.75 0 top
C16  113.79,50.55 270 top
C17  113.92,24.64 270 top
C18  84.84,35.81 0 top
CO.EN  41.91,2.41 0 top
D1  20.95,14.73 180 top
D2  58.8,39.88 270 top
D3  12.45,58.17 90 top
E.STP  8.76,73.41 180 top
F1  3.43,38.48 90 top
FD1  5.71,61.85 0 top
FD2  53.21,28.68 0 top
FD3  3.09,15.35 0 top
GROUND  10.79,52.58 0 bottom
HOLD  33.27,73.53 180 top
ICSP  64.26,39.88 270 top
ICSP1  17.65,58.17 180 top
IOH  29.59,62.74 180 top
IOL  53.98,62.74 180 top
JP2  18.92,53.09 90 top
L  27.3,54.1 270 top
L1  6.99,57.02 180 top
L.H/L  120.65,8 270 top
MOT.PWR  109.35,73.53 180 top
ON  57.79,48.51 270 top
PC1  24.89,21.08 90 top
PC2  17.78,21.08 90 top
POWER  36.2,14.48 0 top
PROBE  54.61,2.41 0 top
R1  18.41,41.53 0 top
R2  40.64,34.67 180 top
R3  62.36,45.21 180 top
RESET  5.71,61.34 0 top
RESET-EN  27.3,39.24 0 top
RESUME  45.47,73.53 180 top
RN1  27.3,35.81 90 top
RN2  27.3,51.31 270 top
RN3  12.19,48.77 90 top
RN4  57.79,45.72 90 top
RN6  107.57,42.29 180 top
RX  27.3,46.23 90 top
SP.DR  16.51,2.41 0 top
SP.SP  29.21,2.41 0 top
T1  7.49,38.48 270 top
TX  27.3,48.51 90 top
U1  7.11,29.34 90 top
U2  21.34,27.18 270 top
U3  19.3,46.61 90 top
U5  18.41,32.26 90 top
X1  4.7,20.32 90 top
X2  3.17,50.04 270 top
X+.LIM  57.53,73.53 180 top
X-.LIM  69.85,73.53 180 top
X.DRV  81.15,55.88 270 top
X.M0  73.53,41.91 270 top
X.M1  76.07,41.91 270 top
X.M2  78.61,41.91 270 top
X.MOT  81.03,72.14 0 top
Y1  18.29,38.1 180 top
Y2  40.64,36.83 0 top
Y+.LIM  122.94,55.12 90 top
Y-.LIM  122.94,42.67 90 top
Y.DRV  97.79,56.01 270 top
Y.M0  90.17,42.04 270 top
Y.M1  92.71,42.04 270 top
Y.M2  95.25,42.04 270 top
Y.MOT  93.98,72.14 0 top
Z1  12.06,51.31 180 top
Z2  12.06,45.59 180 top
Z+.LIM  122.94,29.97 90 top
Z-.LIM  122.94,17.53 90 top
Z.DRV  81.53,24.26 270 top
Z.M0  73.91,10.29 270 top
Z.M1  76.45,10.29 270 top
Z.M2  78.99,10.29 270 top
Z.MOT  76.71,3.81 180 top
ZU4  45.72,28.32 180 top

### Tracks (layer width: path | path; a pad name or v marks a point on that pad's centre or on a via)
5V  (48 unrouted)
  pour Bottom (isolate 0.406, no thermals): 0.25,41.66 10.16,41.66 10.16,33.27 12.06,31.37 12.06,28.07 8.64,24.64 0.25,24.64
  pour Top (no thermals): 0.64,24.64 0.64,41.78 9.53,41.78 9.53,24.64
+3V3  (3 unrouted)
A.A1  (1 unrouted)
A.A2  (1 unrouted)
A.B1  (1 unrouted)
A.B2  (1 unrouted)
AD0  (2 unrouted)
AD1  (2 unrouted)
AD2  (2 unrouted)
AD3  (3 unrouted)
AD4/SDA  (3 unrouted)
AD5/SCL  (5 unrouted)
ADIR  (4 unrouted)
AM0  (1 unrouted)
AM1  (1 unrouted)
AM2  (1 unrouted)
AREF  (2 unrouted)
ASTEP  (4 unrouted)
CMP  (2 unrouted)
D+  (2 unrouted)
D-  (2 unrouted)
DTR  (2 unrouted)
GATE_CMD  (1 unrouted)
GND  (57 unrouted)
  pour Top (isolate 0.406, rank 2): -0.13,42.42 10.79,42.42 10.79,58.29 0,58.29
IO0  (2 unrouted)
IO1  (2 unrouted)
IO2  (3 unrouted)
IO3  (3 unrouted)
IO4  (3 unrouted)
IO5  (3 unrouted)
IO6  (3 unrouted)
IO7  (3 unrouted)
IO8  (6 unrouted)
IO9  (5 unrouted)
L13  (2 unrouted)
LIMSEL  (6 unrouted)
M8RXD  (1 unrouted)
M8TXD  (1 unrouted)
MISO  (6 unrouted)
MISO2  (1 unrouted)
MOSI  (3 unrouted)
MOSI2  (1 unrouted)
N$1  (1 unrouted)
N$3  (2 unrouted)
N$11  (1 unrouted)
N$12  (1 unrouted)
N$13  (1 unrouted)
N$14  (1 unrouted)
N$35  (1 unrouted)
N$36  (1 unrouted)
PB4  (1 unrouted)
PB5  (1 unrouted)
PB6  (1 unrouted)
PB7  (1 unrouted)
PWRIN  (1 unrouted)
RD+  (1 unrouted)
RD-  (1 unrouted)
RESET  (10 unrouted)
RESET2  (3 unrouted)
RXLED  (1 unrouted)
SCK  (4 unrouted)
SCK2  (1 unrouted)
SS  (5 unrouted)
TP_VUCAP  (1 unrouted)
TXLED  (1 unrouted)
UGND  (4 unrouted)
USBVCC  (2 unrouted)
USHIELD  (4 unrouted)
V.MOT  (8 unrouted)
VIN  (4 unrouted)
X.A1  (1 unrouted)
X.A2  (1 unrouted)
X.B1  (1 unrouted)
X.B2  (1 unrouted)
XM0  (1 unrouted)
XM1  (1 unrouted)
XM2  (1 unrouted)
XT1  (3 unrouted)
XT2  (3 unrouted)
XTAL1  (2 unrouted)
XTAL2  (2 unrouted)
XUSB  (1 unrouted)
Y.A1  (1 unrouted)
Y.A2  (1 unrouted)
Y.B1  (1 unrouted)
Y.B2  (1 unrouted)
YM0  (1 unrouted)
YM1  (1 unrouted)
YM2  (1 unrouted)
Z.A1  (1 unrouted)
Z.A2  (1 unrouted)
Z.B1  (1 unrouted)
Z.B2  (1 unrouted)
ZM0  (1 unrouted)
ZM1  (1 unrouted)
ZM2  (1 unrouted)

### Text on the board
Bottom: 2011-3-02
tPlace: 13 | 12 | 11 | 10 | 9 | 8 | 7 | 6 | 5 | 4 | 3 | 2 | 1 | 0
tNames: 2B | 2B | - | - | - | - | - | Mot. Pwr / 12-45V | + | E-Stop | Abort | Hold | Resume | X+ Lim | X- Lim | SCL | SDA | AREF | GND | Y+ Lim | # | # | # | # | # | # | DIGITAL | [#=PWM] | TX | RX | GRBLduino | UNO | TX | Y- Lim | RX | M0 M1 M2 | M0 M1 M2 | 1 | X | A Dir | Y | Z+ Lim | Z | A3 | Z- Lim | A Step | X | ANALOG IN | Y | IOREF | RESET | 3V3 | 5V | GND | VIN | A0 | A1 | A2 | A3 | A4 | A5 | Z | M0 M1 M2 | M0 M1 M2 | A4 | H | |----Spindle----| | Direction | Speed | Coolant | Probe | - | - | - | - | L | 2B | 2B
bNames: E-Stop | Abort | Hold | Resume | X- Lim | X+ Lim | Mot. Pwr / 12-45V | designed by | MADE IN | tinker it | Y+ Lim | Y- Lim | GRBLDuino Uno V1 | Z+ Lim | Z- Lim | Direction | Speed | Coolant | Probe
ReferenceLC: L | TX | ON | RX | PC1 | PC2
214bmp: D:/SmartProjects/Snc/a4_bn_logo2.bmp